# Altium schematic sheet EM2050.SchDoc
size 420 x 297 mm; ENG_APP_DATE: --/--/--; DSN_APP_DATE: --/--/--; CHK_APP_DATE: --/--/--; Date: TEST; SheetNumber: 2; SheetTotal: 5; Sheet_Text_ProjectName: ApolloEcho_Dev_Kit; Sheet_Text_Author: mtnguyen; Sheet_Text_Title: EM2050; Sheet_Text_Rev: 1.0.0; Sheet_Text_Date: Dec 03, 24; SPICEModelCacheUWNOKGRN: <root> / <DocumentId>UWNOKGRN</DocumentId> / <CacheFrame Number="0"> / <Model Name="emk105bj105_v-f" Kind="CKT"> / <Text>* EMK105BJ105_V-F     SPICE MODEL  ( General Type ) / *-------------------------------------------------------------------------------------------------------- / * Model Generated by TAIYO YUDEN Corporation (http://www.ty-top.com) / * Version 1.0 / * TAIYO YUDEN Control No. 170508_130520 / * Copyright(c) 2012 TAIYO YUDEN CO.,LTD. All Rights Reserved. / *-------------------------------------------------------------------------------------------------------- / * / * Products Name : Multilayer Ceramic Capacitors / * / * Characteristics : / *     Capacitance : 1 uF , Rated Voltage : 16V , TCC : X5R / *     Case Size : 1.0 x 0.5 / 0.039 x 0.02 [mm/inch] , Thickness : 0.5 / 0.02 [mm/inch] / *     (Conditions: Temperature = 25 degC , DC Bias Current/Voltage = 0A / 0V) / * / * Frequency Range : 40Hz - 3GHz / * / * External Node Assignments : / * / *  1  o---| |---o  2 / * / *-------------------------------------------------------------------------------------------------------- / .SubCkt EMK105BJ105_V-F 1 2 / **************************** / C0 1 110 0.68309u / Cm 1 101 0.26053u / C1 101 102 0.94076u / Rc1 101 102 1.9029k / C2 102 103 0.66707u / Rc2 102 103 120.36 / C3 103 110 0.57203u / Rc3 103 110 2.1097 / C2m 1 301 0.1871u / C21 301 302 3.2494u / Rc21 301 302 1.1117k / C22 302 303 2.1014u / Rc22 302 303 1.484k / C23 303 304 2.1172u / Rc23 303 304 1.3876k / C24 304 305 0.75729u / Rc24 304 305 332.59 / C25 305 306 0.94401u / Rc25 305 306 249.09 / C26 306 307 0.34674u / Rc26 306 307 28.352 / C27 307 308 0.37158u / Rc27 307 308 19.989 / C28 308 309 0.17933u / Rc28 308 309 31.748 / C29 309 110 0.016445u / Rc29 309 110 1.0592 / Rp0 1 110 100Meg / L0 110 120 0.2216n / Lm 120 130 0.1509n / L1 120 121 0.12659n / RL1 121 130 0.85161 / L2 120 122 0.15996n / RL2 122 130 0.42469 / L3 120 123 7.9543n / RL3 123 130 0.54643m / CR 120 124 0.24334u / LR 124 125 0.090738n / RR 125 130 68.076m / CL 130 140 2.7354p / LL 130 140 0.10762n / RL 130 140 50.614 / Rs 140 2 7.5416m / **************************** / .ends EMK105BJ105_V-F</Text> / </Model> / </CacheFrame> / </root>
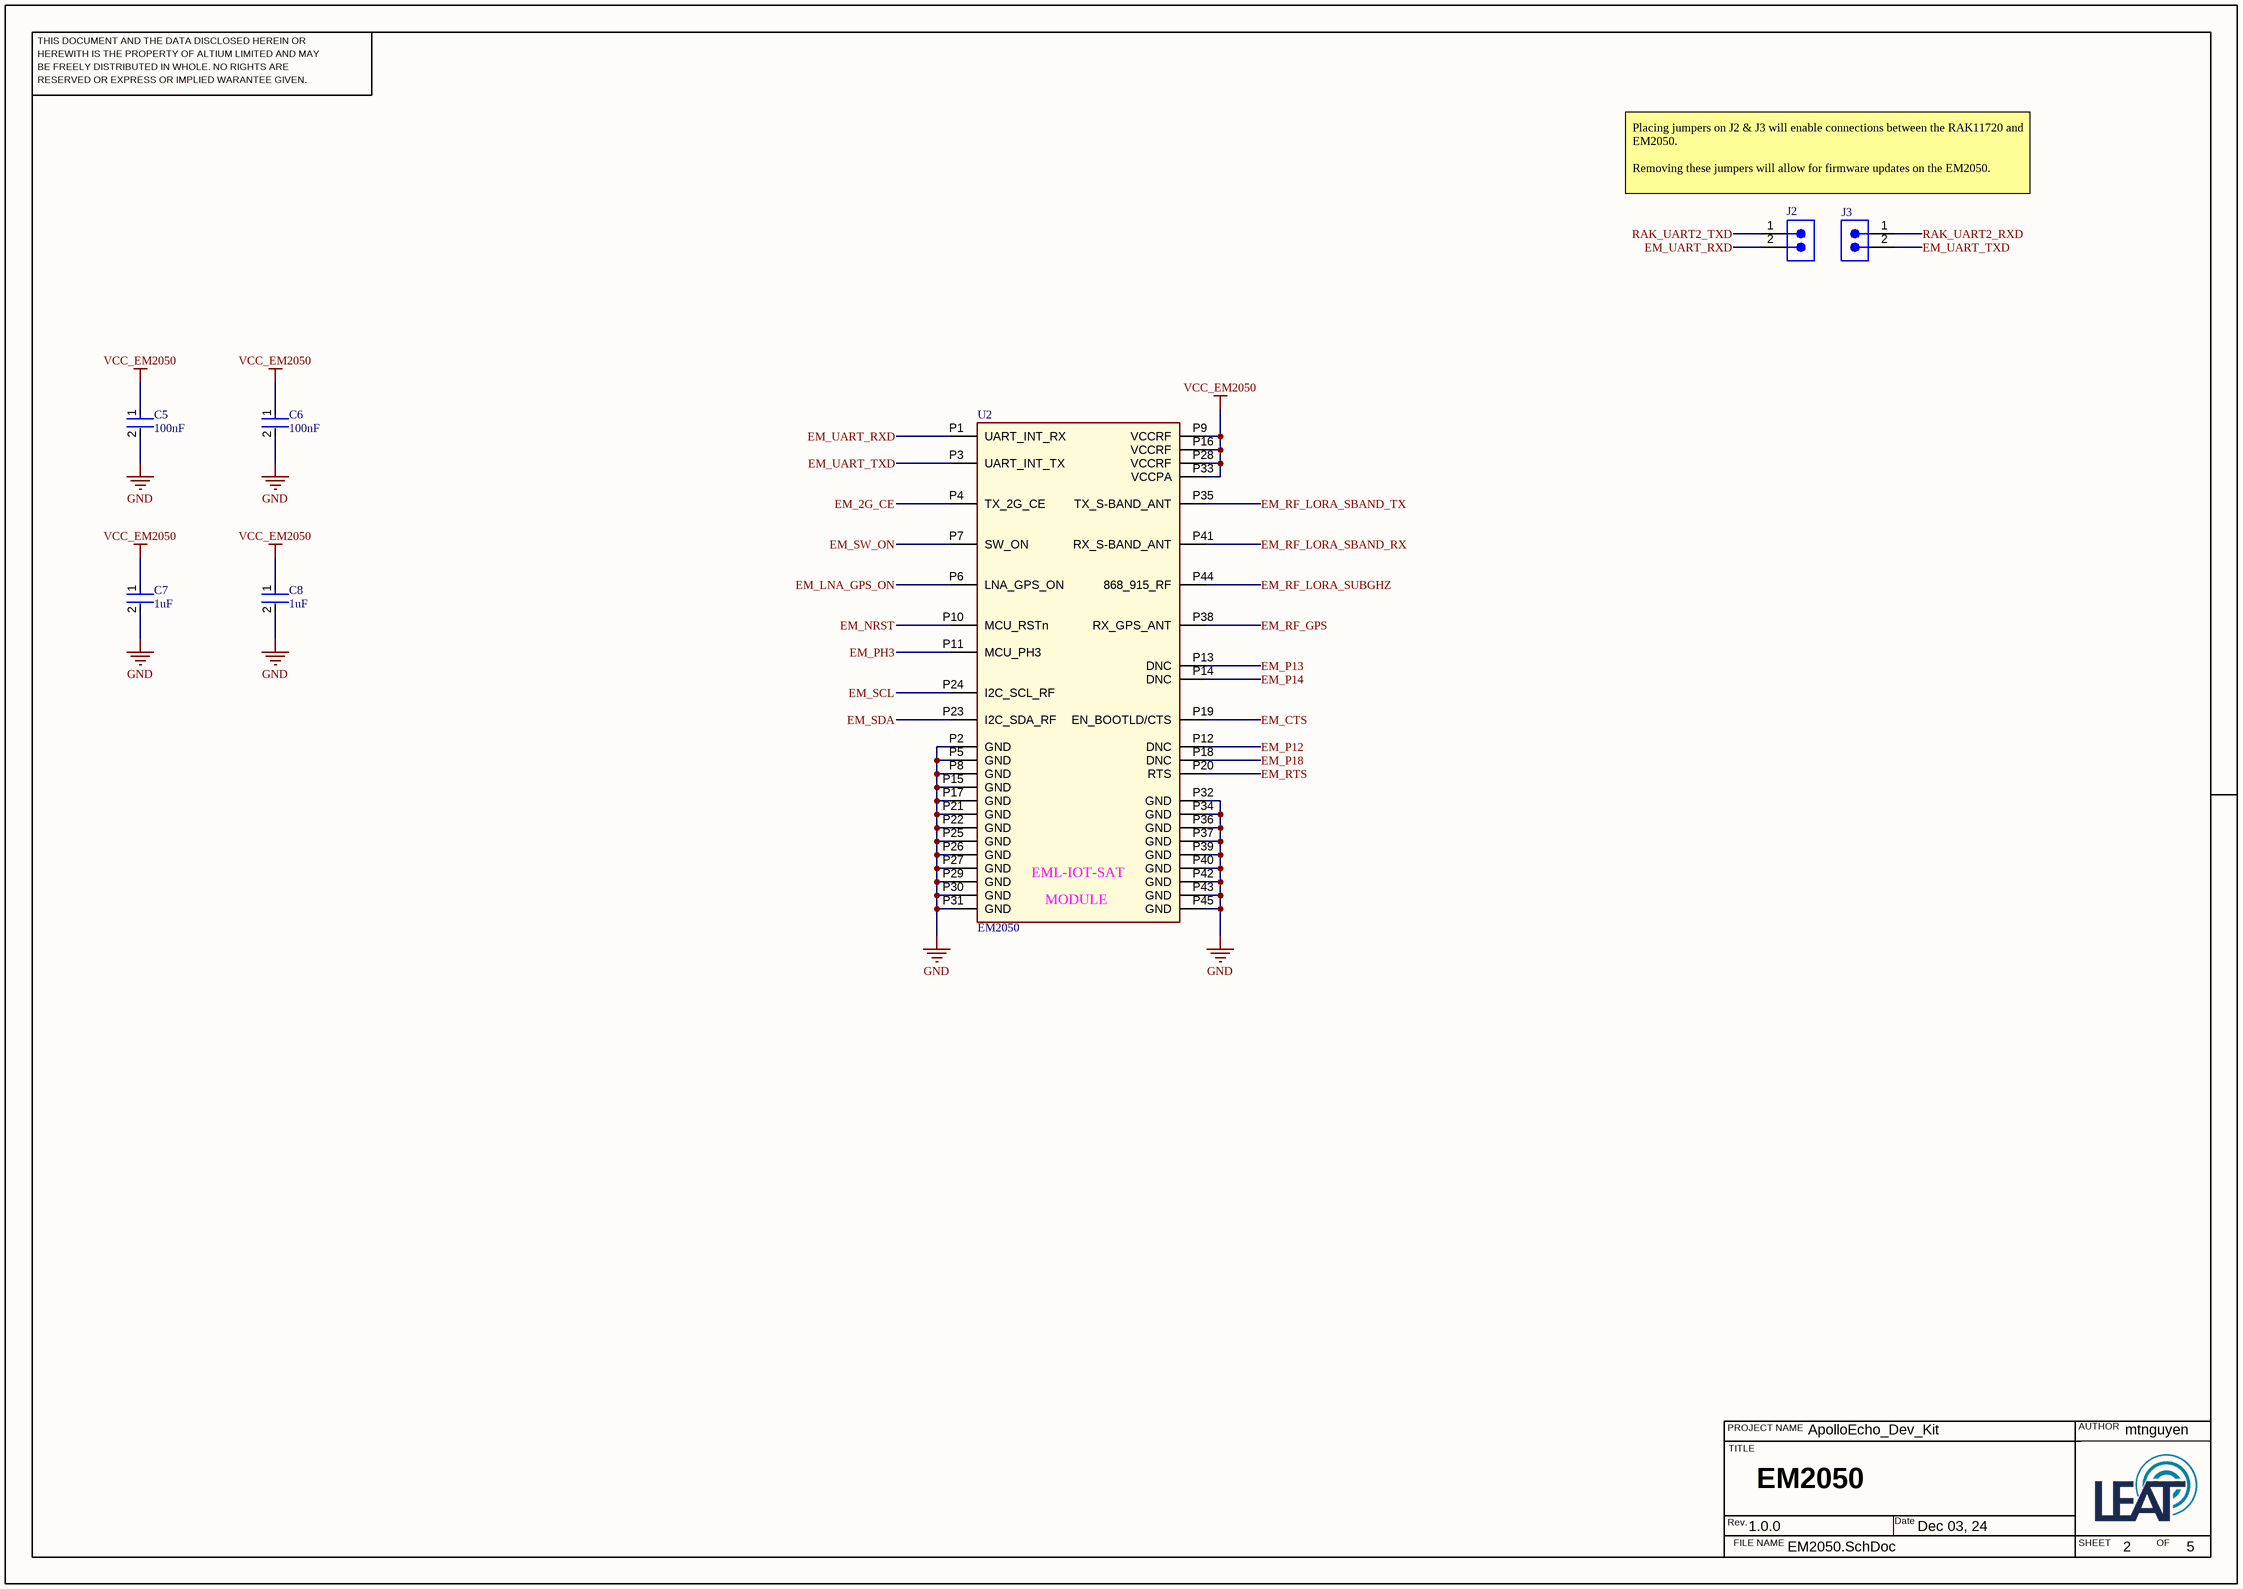
[diagram p0: EM2050.SchDoc]

## Parts
C5  Capacitance: 100nF  [FP-0402-L_1_0_1-W_0_5_0_1-IPC_C]  (hidden comment: 0402ZD104KAT2A)
C6  Capacitance: 100nF  [FP-0402-L_1_0_1-W_0_5_0_1-IPC_C]  (hidden comment: 0402ZD104KAT2A)
C7  Capacitance: 1uF  [FP-0402-L_1_0_0_05-W_0_5-IPC_A]  (hidden comment: EMK105BJ105KV-F)
C8  Capacitance: 1uF  [FP-0402-L_1_0_0_05-W_0_5-IPC_A]  (hidden comment: EMK105BJ105KV-F)
J2  61300211121  [61300211121]  (value not drawn)
J3  61300211121  [61300211121]  (value not drawn)
U2  value EM2050  [EM2050]  (hidden comment: IOT SAT module)

## Nets
GND: C5.2 C6.2 C7.2 C8.2 U2.P2(GND) U2.P5(GND) U2.P8(GND) U2.P15(GND) U2.P17(GND) U2.P21(GND) U2.P22(GND) U2.P25(GND) U2.P26(GND) U2.P27(GND) U2.P29(GND) U2.P30(GND) U2.P31(GND) U2.P32(GND) U2.P34(GND) U2.P36(GND) U2.P37(GND) U2.P39(GND) U2.P40(GND) U2.P42(GND) U2.P43(GND) U2.P45(GND)
VCC_EM2050: C5.1 C6.1 C7.1 C8.1 U2.P9(VCCRF) U2.P16(VCCRF) U2.P28(VCCRF) U2.P33(VCCPA)
EM_2G_CE: U2.P4(TX_2G_CE)
EM_CTS: U2.P19(EN_BOOTLD/CTS)
EM_LNA_GPS_ON: U2.P6(LNA_GPS_ON)
EM_NRST: U2.P10(MCU_RSTn)
EM_P12: U2.P12(DNC)
EM_P13: U2.P13(DNC)
EM_P14: U2.P14(DNC)
EM_P18: U2.P18(DNC)
EM_PH3: U2.P11(MCU_PH3)
EM_RF_GPS: U2.P38(RX_GPS_ANT)
EM_RF_LORA_SBAND_RX: U2.P41(RX_S-BAND_ANT)
EM_RF_LORA_SBAND_TX: U2.P35(TX_S-BAND_ANT)
EM_RF_LORA_SUBGHZ: U2.P44(868_915_RF)
EM_RTS: U2.P20(RTS)
EM_SCL: U2.P24(I2C_SCL_RF)
EM_SDA: U2.P23(I2C_SDA_RF)
EM_SW_ON: U2.P7(SW_ON)
EM_UART_RXD: J2.2 U2.P1(UART_INT_RX)
EM_UART_TXD: J3.2 U2.P3(UART_INT_TX)
RAK_UART2_RXD: J3.1
RAK_UART2_TXD: J2.1

## Notes on the sheet
- Placing jumpers on J2 & J3 will enable connections between the RAK11720 and EM2050.
  Removing these jumpers will allow for firmware updates on the EM2050.
- THIS DOCUMENT AND THE DATA DISCLOSED HEREIN OR
- HEREWITH IS THE PROPERTY OF ALTIUM LIMITED AND MAY
- BE FREELY DISTRIBUTED IN WHOLE. NO RIGHTS ARE
- RESERVED OR EXPRESS OR IMPLIED WARANTEE GIVEN.
- PROJECT NAME
- TITLE
- AUTHOR
- Rev.
- FILE NAME
- Date
- SHEET
- OF
- (in symbol EM2050) EML-IOT-SAT; MODULE

## Library data of the parts
C5 C6 = CMP-2008-02878-3: General Purpose Ceramic Capacitor, 0402, 100nF, 10%, X5R, 15%, 10V; Dissipation Factor: 5%; Insulation Resistance: 100GR; Case/Package: 0402; Termination: SMD/SMT; Thickness: 0.022inch; Packaging: Tape and Reel; REACH SVHC: No SVHC; Case Code (Imperial): 0402; Width: 0.02inch; Series: -; Construction: Flat; Dielectric: X5R; Voltage: 10V; Height: 0.56mm; Voltage Rating (DC): 10V; Depth: 0.5mm; Tolerance: 10%; Radiation Hardening: No; Voltage Rating: 10V; Package Quantity: 1; Contact Plating: Tin; RoHS Compliant: Yes; Case Code (Metric): 1005; Lead Free: Lead Free; Max Operating Temperature: 85°C; Length: 1mm; Min Operating Temperature: -55°C; Mount: Surface Mount
C7 C8 = CMP-14477-000104-2: None; Tolerance: 10%; Voltage Rating: 16V; Dielectric: X5R; Packaging: Tape and Reel; Depth: 0.5mm; Mount: Surface Mount; Thickness: 0.022inch; Package Quantity: 1; Min Operating Temperature: -55°C; Series: M; Voltage Rating (DC): 16V; Termination: SMD/SMT; Case/Package: 0402; Number of Pins: 2; Case Code (Imperial): 0402; Length: 1mm; Halogen Free: Halogen Free; Case Code (Metric): 1005; Width: 0.02inch; RoHS Compliant: Yes; Radiation Hardening: No; Max Operating Temperature: 85°C; Height: 0.5mm; Construction: Flat
J2 J3 = CMP-1712-00002-6: NexarPartId: 20081794; Number of Contacts: 2; Pitch: 2.54mm; Connector Type: Male Pin; Voltage Rating: 250V; Current Rating: 3A; Gender: Male; Contact Resistance: 20mΩ; Height: 8.94mm; Lead Free: Lead Free; Number of Pins: 2; Termination: Through Hole; RoHS: Compliant; Lead Pitch: 2.54mm; REACH SVHC: No SVHC; Housing Material: PBT; Contact Mating Length: 5.9944mm; Min Operating Temperature: -40°C; Orientation: Vertical; Contact Material: Copper; Contact Gender: Male; Max Operating Temperature: 125°C; Number of Rows: 1; Number of Positions: 2; Packaging: Bulk; Contact Plating: Gold; Mount: Through Hole; Color: Black; Operating Supply Voltage: 250V
U2 = EM2050: Echostar Mobile IOT SAT Module - Basic version; Manufacturer: Echostar Mobile Ltd; Release: 1.0; VCCRF: 3.3V; Package: Module SMD 47x32mm; Manufacturer P/N: EM2050; Release date: 01/08/2022; RoHS Compliant: Yes; MSL: 3; VCCPA: 3.3V